# EasyEDA Pro project ProPrj_电容计量V2_2026-06-24.epro, schematic Schematic17
Board Name: Board1; Create Date: 2026-04-20; Page Name: P1; Project Name: 电容计量V2; Schematic Name: Schematic17; Update Date: 2026-04-20; Page Size: A4; Version: V1.0
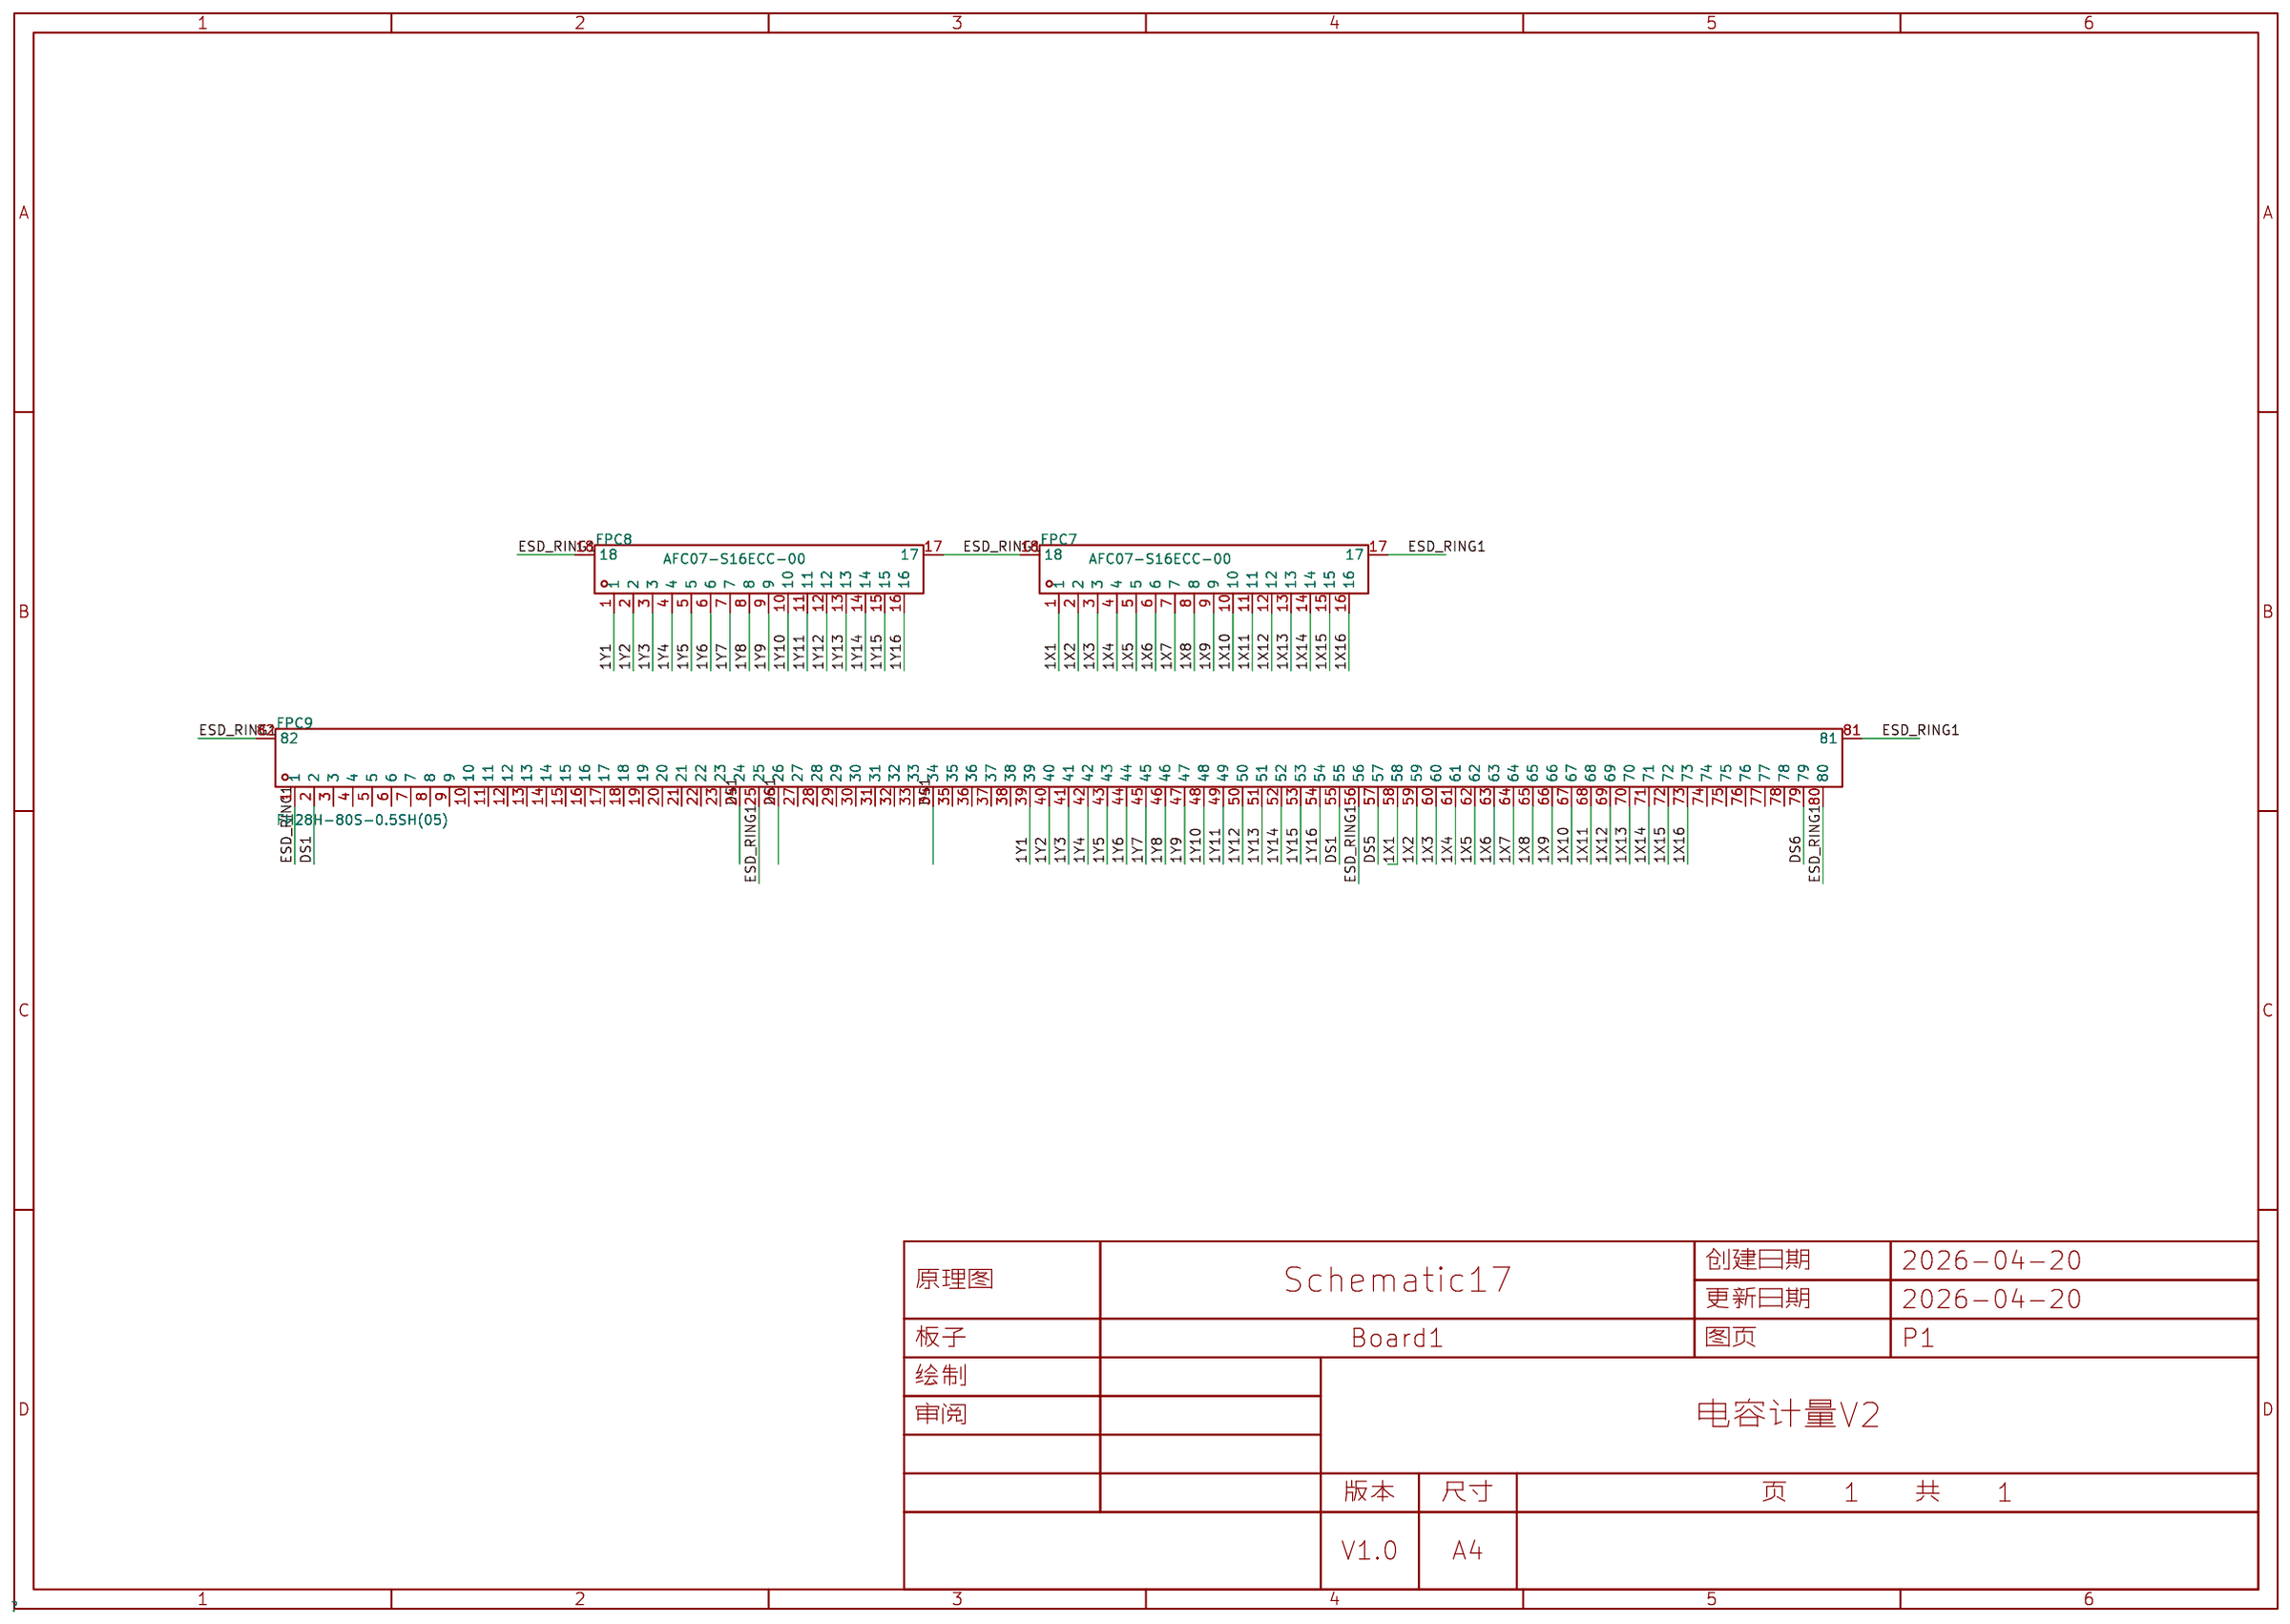
[diagram p4: schematic sheet]

## Parts
FPC7  AFC07-S16ECC-00  [FPC-SMD_16P-P0.50_AFC07-S16ECC-00]
FPC8  AFC07-S16ECC-00  [FPC-SMD_16P-P0.50_AFC07-S16ECC-00]
FPC9  FH28H-80S-0.5SH(05)  [FFC-SMD_80P-P0.50_FH28H-80S-0.5SH]

## Library data of the parts
FPC7 FPC8 = AFC07-S16ECC-00: 锁定特性:抽屉式;触点类型:上接;触点数量:16P;间距:0.5mm;安装方式:卧贴;工作温度:-25℃~+85℃;; LCSC Part Name: 抽屉式 上接 P数:16P 间距:0.5mm; Supplier Part: C11088; Manufacturer: JS(钜硕电子); Supplier Footprint: SMD,P=0.5mm,卧贴; JLCPCB Part Class: Extended Part; Datasheet: https://item.szlcsc.com/datasheet/AFC07-S16ECC-00/11635.html; Supplier: LCSC; Locking Feature: 抽屉式; Contact Type: 上接; Number of Contacts: 16P; Pitch: 0.5mm; Mounting Type: 卧贴; FFC, FCB Thickness: 0.3mm; Height Above Board: 2mm; Contact Material: 磷青铜; Contact Plating: 锡; Operating Temperature: -25℃~+85℃; Rated Voltage (Max): 50V; Current Rating (Max): 400mA
FPC9 = FH28H-80S-0.5SH(05): 锁定特性:-;触点类型:下接;触点数量:80P;间距:0.5mm;安装类型:卧贴;工作温度范围:-40℃~+105℃;; LCSC Part Name: 间距:0.5mm P数:80P 下接; Supplier Part: C424679; Manufacturer: HRS(广濑); Supplier Footprint: SMD,P=0.5mm,卧贴; JLCPCB Part Class: Extended Part; Datasheet: https://atta.szlcsc.com/upload/public/pdf/source/20190903/C424679_77A87A094313EE4221719E31E2589B07.pdf; Supplier: LCSC; Contact Type: 下接; Number of Contacts: 80P; Pitch: 0.5mm; Mounting Type: 卧贴; FFC, FCB Thickness: 0.3mm; Height Above Board: 2.54mm; Contact Material: 磷青铜; Contact Plating: 金; Operating Temperature Range: -40℃~+105℃

## Nets
1X1: FPC7.1 FPC9.58
1X2: FPC7.2 FPC9.59
1X3: FPC7.3 FPC9.60
1X4: FPC7.4 FPC9.61
1X5: FPC7.5 FPC9.62
1X6: FPC7.6 FPC9.63
1X7: FPC7.7 FPC9.64
1X8: FPC7.8 FPC9.65
1X9: FPC7.9 FPC9.66
1X10: FPC7.10 FPC9.67
1X11: FPC7.11 FPC9.68
1X12: FPC7.12 FPC9.69
1X13: FPC7.13 FPC9.70
1X14: FPC7.14 FPC9.71
1X15: FPC7.15 FPC9.72
1X16: FPC7.16 FPC9.73
1Y1: FPC8.1 FPC9.39
1Y2: FPC8.2 FPC9.40
1Y3: FPC8.3 FPC9.41
1Y4: FPC8.4 FPC9.42
1Y5: FPC8.5 FPC9.43
1Y6: FPC8.6 FPC9.44
1Y7: FPC8.7 FPC9.45
1Y8: FPC8.8 FPC9.46
1Y9: FPC8.9 FPC9.47
1Y10: FPC8.10 FPC9.48
1Y11: FPC8.11 FPC9.49
1Y12: FPC8.12 FPC9.50
1Y13: FPC8.13 FPC9.51
1Y14: FPC8.14 FPC9.52
1Y15: FPC8.15 FPC9.53
1Y16: FPC8.16 FPC9.54
DS1: FPC9.2 FPC9.24 FPC9.26 FPC9.34 FPC9.55
DS5: FPC9.57
DS6: FPC9.79
ESD_RING1: FPC7.17 FPC7.18 FPC8.17 FPC8.18 FPC9.1 FPC9.25 FPC9.56 FPC9.80 FPC9.81 FPC9.82

Not connected (* = marked no-connect by the designer): FPC9 3 4 5 6 7 8 9 10 11 12 13 14 15 16 17 18 19 20 21 22 23 27 28 29 30 31 32 33 35 36 37 38 74 75 76 77 78
